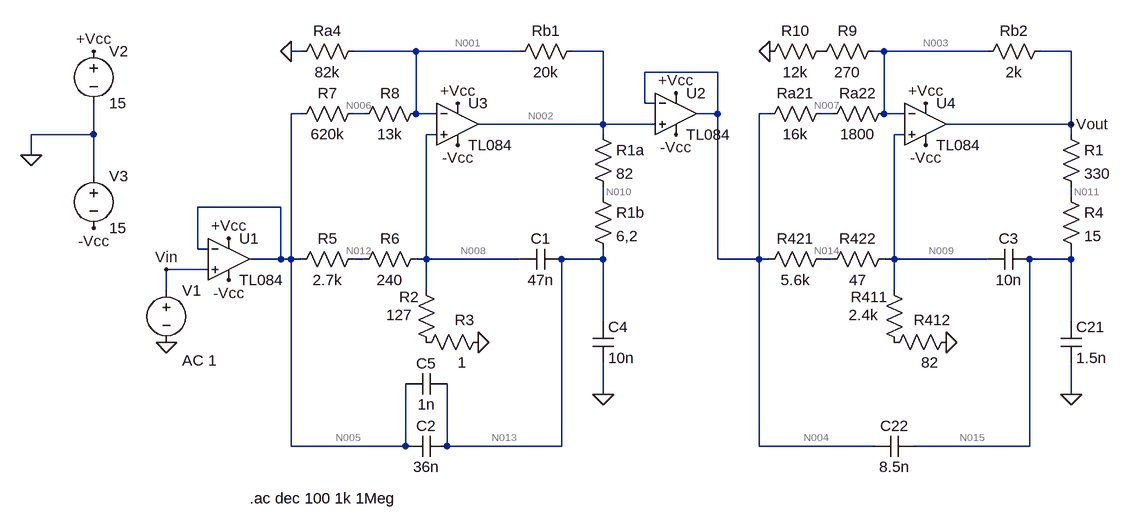
[diagram p0: schematic Sedra_Nom.asc]
* Sedra_Nom.asc
V1 Vin 0 AC 1
V2 +Vcc 0 15
V3 0 -Vcc 15
C1 N013 N008 47n
Ra4 N001 0 82k
Rb1 N002 N001 20k
C4 N013 0 10n
* U3: TL084 (symbol sympropio\TL084 not available, pins judged from their places): In+=N008 In-=N001 V+=+Vcc V-=-Vcc OUT=N002
C2 N013 N005 36n
C5 N005 N013 1n
R1a N002 N010 82
R1b N010 N013 6,2
R2 N008 P001 127
R3 0 P001 1
R5 N012 N005 2.7k
R6 N008 N012 240
R7 N006 N005 620k
R8 N001 N006 13k
* U1: TL084 (symbol sympropio\TL084 not available, pins judged from their places): In+=Vin In-=N005 V+=+Vcc V-=-Vcc OUT=N005
* U2: TL084 (symbol sympropio\TL084 not available, pins judged from their places): In+=N002 In-=N004 V+=+Vcc V-=-Vcc OUT=N004
C3 N015 N009 10n
Rb2 Vout N003 2k
C21 N015 0 1.5n
* U4: TL084 (symbol sympropio\TL084 not available, pins judged from their places): In+=N009 In-=N003 V+=+Vcc V-=-Vcc OUT=Vout
C22 N015 N004 8.5n
R1 Vout N011 330
R4 N011 N015 15
R411 N009 P002 2.4k
R412 0 P002 82
R421 N014 N004 5.6k
R422 N009 N014 47
Ra21 N007 N004 16k
Ra22 N003 N007 1800
R9 N003 P003 270
R10 P003 0 12k
.ac dec 100 1k 1Meg
.backanno
.end

* Results of the author's LTspice run, read from the files saved beside the schematic
* Operating Point, zero values left out:
*   V(+vcc) = 15 V
*   V(-vcc) = -15 V
*   V(n013) = 15.12 µV
*   V(n008) = 452.2 nV
*   V(n001) = 11.42 µV
*   V(n002) = 15.12 µV
*   V(n005) = 10.97 µV
*   V(n010) = 15.12 µV
*   V(n012) = 1.311 µV
*   V(n006) = 11.41 µV
*   V(n004) = 26.09 µV
*   V(n015) = 21.21 µV
*   V(n009) = 7.89 µV
*   V(vout) = 21.21 µV
*   V(n003) = 18.86 µV
*   V(n011) = 21.21 µV
*   V(p002) = 260.7 nV
*   V(n014) = 8.041 µV
*   V(n007) = 19.59 µV
*   V(p003) = 18.44 µV
*   I(R10) = 1.537 nA
*   I(R9) = 1.537 nA
*   I(Ra22) = -406.4 pA
*   I(Ra21) = -406.4 pA
*   I(R422) = -3.224 nA
*   I(R421) = -3.224 nA
*   I(R412) = -3.179 nA
*   I(R411) = 3.179 nA
*   I(Rb2) = 1.176 nA
*   I(R6) = -3.578 nA
*   I(R5) = -3.578 nA
*   I(R3) = -3.533 nA
*   I(R2) = 3.533 nA
*   I(Rb1) = 185.1 pA
*   I(Ra4) = 139.3 pA
*   I(V3) = -56.78 mA
*   I(V2) = -56.78 mA
*   I(V1) = -45.05 pA
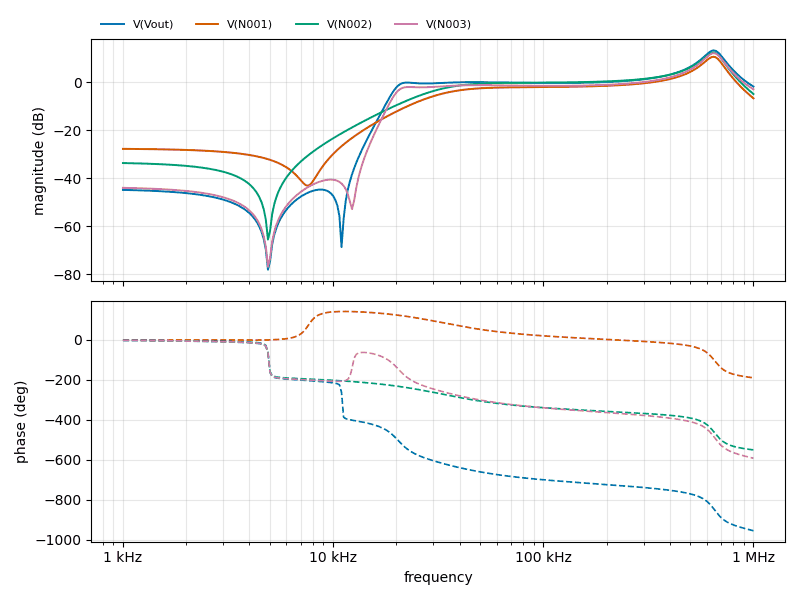
[diagram p1: AC Analysis of Sedra_Nom.asc, plotted from the saved traces]
* AC Analysis, 1 run:
*   V(Vout): -44.87 dB at 1 kHz, -1.75 dB at 1 MHz, peak 13.34 dB at 645.7 kHz, 3 dB below the peak at 576.2 kHz and 713.6 kHz
*   V(N001): -27.74 dB at 1 kHz, -6.66 dB at 1 MHz, peak 10.68 dB at 645.7 kHz, 3 dB below the peak at 571 kHz and 709.3 kHz
*   V(N002): -33.67 dB at 1 kHz, -4.88 dB at 1 MHz, peak 12.49 dB at 645.7 kHz, 3 dB below the peak at 571 kHz and 709.2 kHz
*   V(N003): -44.01 dB at 1 kHz, -2.89 dB at 1 MHz, peak 12.20 dB at 645.7 kHz, 3 dB below the peak at 576.2 kHz and 713.6 kHz